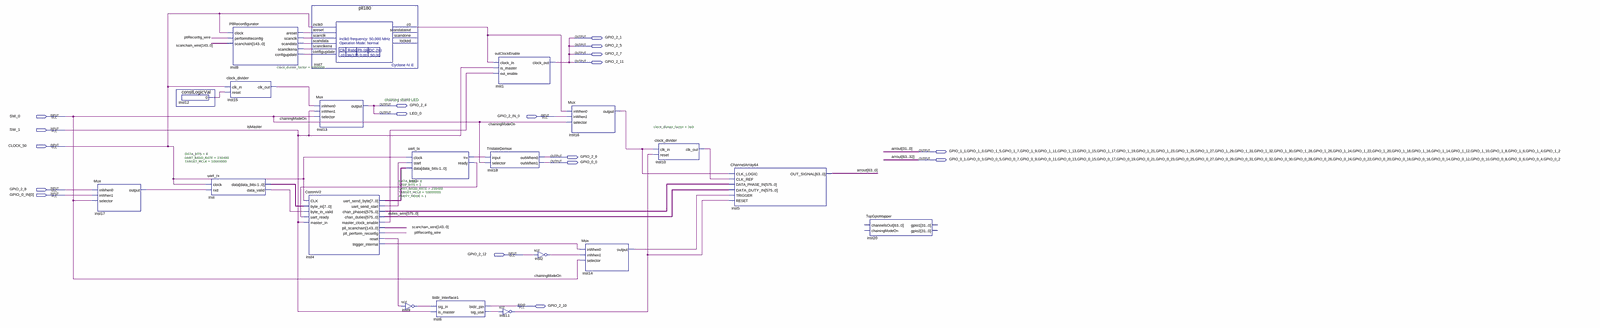
[diagram p0: schematic sheet, whole]
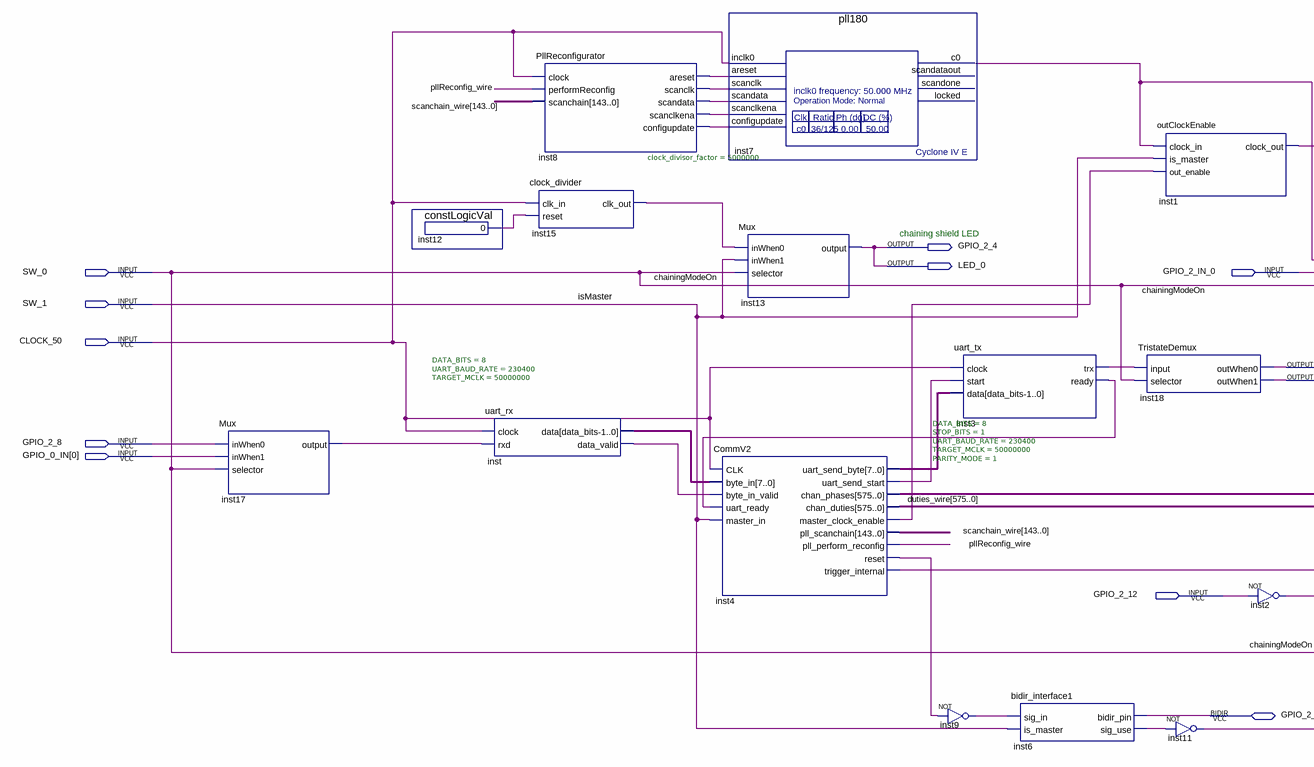
[diagram p1: schematic sheet, left part]
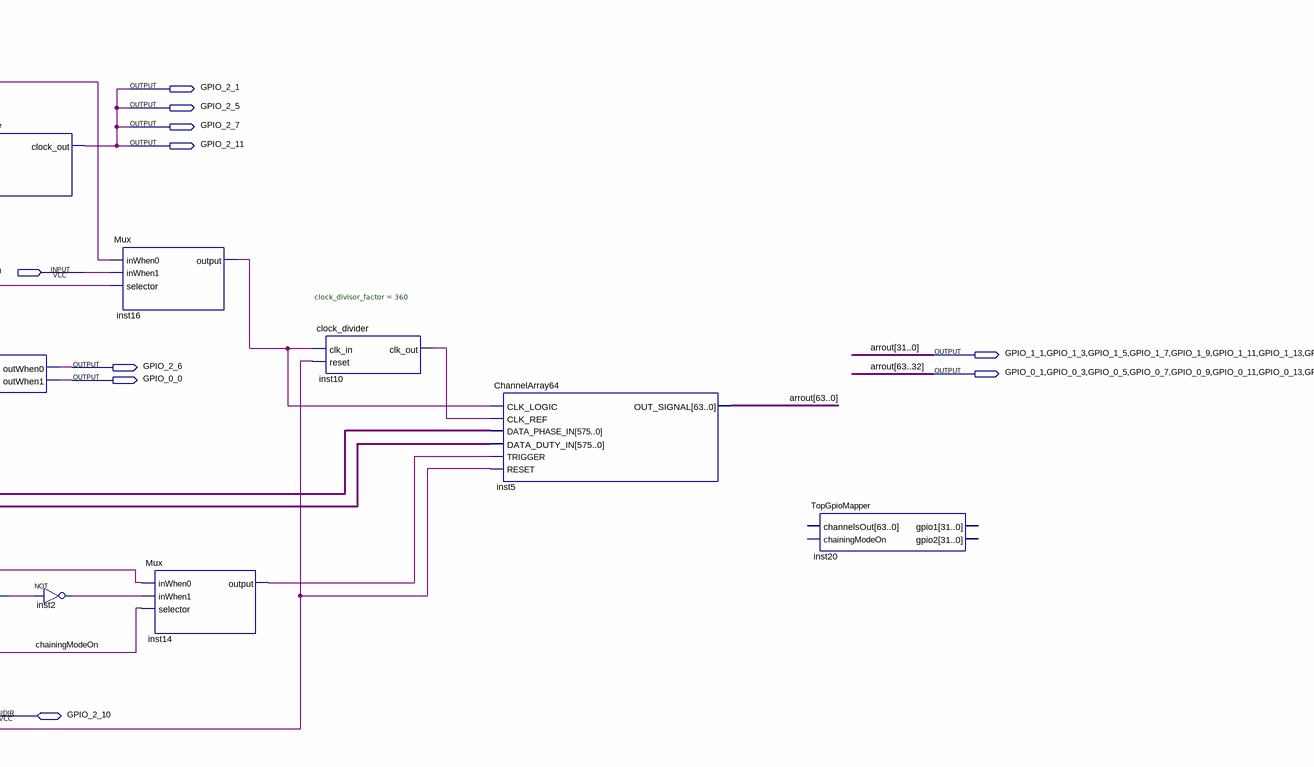
[diagram p2: schematic sheet, centre part]
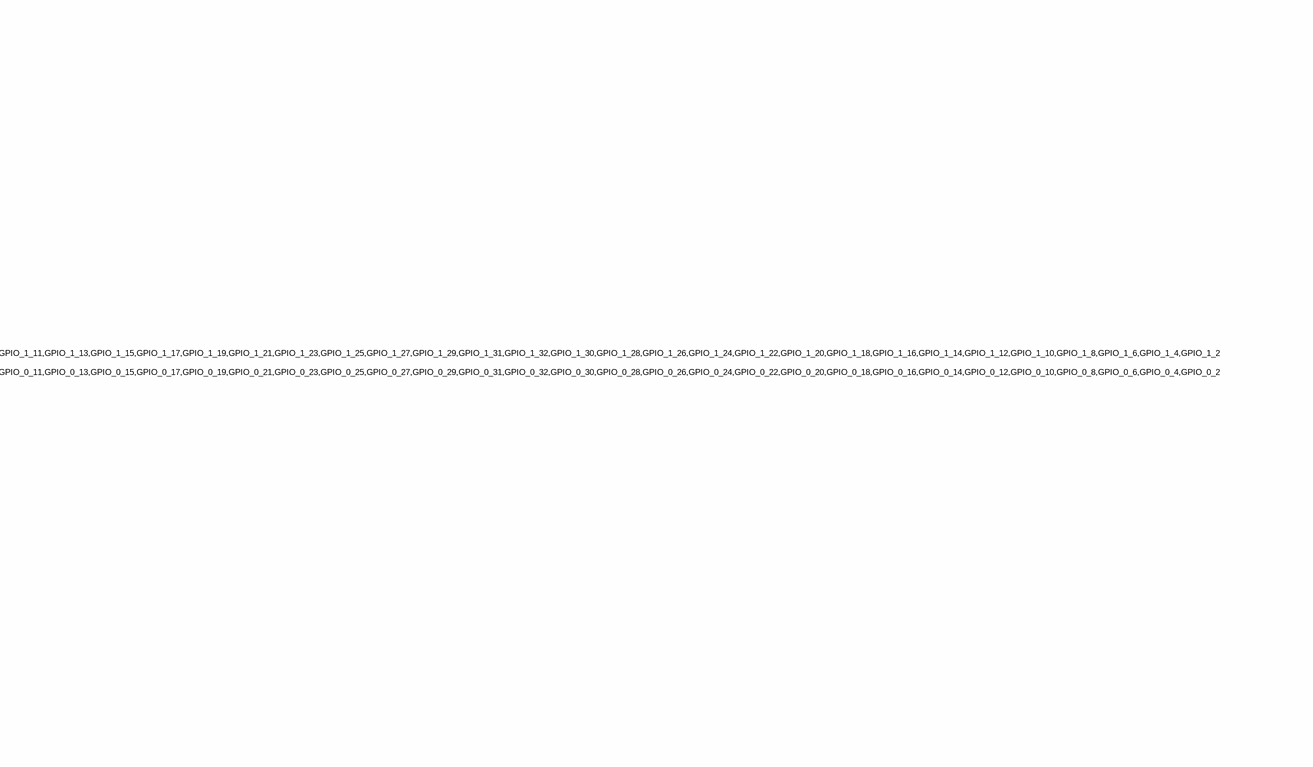
[diagram p3: schematic sheet, right part]
// Quartus schematic ShiftedSignalGenerator.bdf as structural Verilog: 20 symbols, 18 pins
module ShiftedSignalGenerator (
  input  SW_0,
  input  GPIO_2_IN_0,
  input  SW_1,
  input  CLOCK_50,
  input  GPIO_2_8,
  input  [0:0] GPIO_0_IN,
  input  GPIO_2_12,
  inout  GPIO_2_10,
  output GPIO_2_1,
  output GPIO_2_5,
  output GPIO_2_7,
  output GPIO_2_11,
  output GPIO_2_4,
  output LED_0,
  output GPIO_1_1,
  output GPIO_1_3,
  output GPIO_1_5,
  output GPIO_1_7,
  output GPIO_1_9,
  output GPIO_1_11,
  output GPIO_1_13,
  output GPIO_1_15,
  output GPIO_1_17,
  output GPIO_1_19,
  output GPIO_1_21,
  output GPIO_1_23,
  output GPIO_1_25,
  output GPIO_1_27,
  output GPIO_1_29,
  output GPIO_1_31,
  output GPIO_1_32,
  output GPIO_1_30,
  output GPIO_1_28,
  output GPIO_1_26,
  output GPIO_1_24,
  output GPIO_1_22,
  output GPIO_1_20,
  output GPIO_1_18,
  output GPIO_1_16,
  output GPIO_1_14,
  output GPIO_1_12,
  output GPIO_1_10,
  output GPIO_1_8,
  output GPIO_1_6,
  output GPIO_1_4,
  output GPIO_1_2,
  output GPIO_2_6,
  output GPIO_0_1,
  output GPIO_0_3,
  output GPIO_0_5,
  output GPIO_0_7,
  output GPIO_0_9,
  output GPIO_0_11,
  output GPIO_0_13,
  output GPIO_0_15,
  output GPIO_0_17,
  output GPIO_0_19,
  output GPIO_0_21,
  output GPIO_0_23,
  output GPIO_0_25,
  output GPIO_0_27,
  output GPIO_0_29,
  output GPIO_0_31,
  output GPIO_0_32,
  output GPIO_0_30,
  output GPIO_0_28,
  output GPIO_0_26,
  output GPIO_0_24,
  output GPIO_0_22,
  output GPIO_0_20,
  output GPIO_0_18,
  output GPIO_0_16,
  output GPIO_0_14,
  output GPIO_0_12,
  output GPIO_0_10,
  output GPIO_0_8,
  output GPIO_0_6,
  output GPIO_0_4,
  output GPIO_0_2,
  output GPIO_0_0
);

  wire inst2_out, inst3_ready, inst3_trx, inst4_master_clock_enable, inst4_reset, inst4_trigger_internal,
       inst4_uart_send_start, inst6_sig_use, inst7_c0, inst8_areset, inst8_configupdate, inst8_scanclk,
       inst8_scanclkena, inst8_scandata, inst9_out, inst10_clk_out, inst11_out, inst12_result, inst14_output,
       inst15_clk_out, inst16_output, inst17_output, inst_data_valid, pllReconfig_wire;
  wire [7:0] inst4_uart_send_byte, inst_data;
  wire [143:0] scanchain_wire;
  wire [575:0] duties_wire, inst4_chan_phases;

  Mux inst17 (.inWhen0(GPIO_2_8), .inWhen1(GPIO_0_IN[0]), .selector(SW_0), .\output (inst17_output));
  constLogicVal inst12 (.result(inst12_result));
  uart_rx #(.DATA_BITS(8), .UART_BAUD_RATE(230400), .TARGET_MCLK(50000000)) inst (
    .clock(CLOCK_50), .rxd(inst17_output), .data(inst_data), .data_valid(inst_data_valid));
  PllReconfigurator inst8 (
    .clock(CLOCK_50), .performReconfig(pllReconfig_wire), .scanchain(scanchain_wire), .areset(inst8_areset),
    .scanclk(inst8_scanclk), .scandata(inst8_scandata), .scanclkena(inst8_scanclkena),
    .configupdate(inst8_configupdate));
  clock_divider #(.clock_divisor_factor(5000000)) inst15 (
    .clk_in(CLOCK_50), .reset(inst12_result), .clk_out(inst15_clk_out));
  pll180 inst7 (
    .inclk0(CLOCK_50), .areset(inst8_areset), .scanclk(inst8_scanclk), .scandata(inst8_scandata),
    .scanclkena(inst8_scanclkena), .configupdate(inst8_configupdate), .c0(inst7_c0));  // open: scandataout, scandone, locked
  Mux inst13 (.inWhen0(inst15_clk_out), .inWhen1(SW_1), .selector(SW_0), .\output (GPIO_2_4));
  CommV2 inst4 (
    .CLK(CLOCK_50), .byte_in(inst_data), .byte_in_valid(inst_data_valid), .uart_ready(inst3_ready),
    .master_in(SW_1), .uart_send_byte(inst4_uart_send_byte), .uart_send_start(inst4_uart_send_start),
    .chan_phases(inst4_chan_phases), .chan_duties(duties_wire),
    .master_clock_enable(inst4_master_clock_enable), .pll_scanchain(scanchain_wire),
    .pll_perform_reconfig(pllReconfig_wire), .reset(inst4_reset), .trigger_internal(inst4_trigger_internal));
  not inst9 (inst9_out, inst4_reset);
  uart_tx #(.DATA_BITS(8), .STOP_BITS(1), .UART_BAUD_RATE(230400), .TARGET_MCLK(50000000), .PARITY_MODE(1)) inst3 (
    .clock(CLOCK_50), .start(inst4_uart_send_start), .data(inst4_uart_send_byte), .trx(inst3_trx),
    .ready(inst3_ready));
  bidir_interface1 inst6 (.sig_in(inst9_out), .is_master(SW_1), .sig_use(inst6_sig_use), .bidir_pin(GPIO_2_10));
  TristateDemux inst18 (.\input (inst3_trx), .selector(SW_0), .outWhen0(GPIO_2_6), .outWhen1(GPIO_0_0));
  outClockEnable inst1 (
    .clock_in(inst7_c0), .is_master(SW_1), .out_enable(inst4_master_clock_enable), .clock_out(GPIO_2_1));
  not inst11 (inst11_out, inst6_sig_use);
  not inst2 (inst2_out, GPIO_2_12);
  Mux inst16 (.inWhen0(inst7_c0), .inWhen1(GPIO_2_IN_0), .selector(SW_0), .\output (inst16_output));
  Mux inst14 (.inWhen0(inst4_trigger_internal), .inWhen1(inst2_out), .selector(SW_0), .\output (inst14_output));
  clock_divider #(.clock_divisor_factor(360)) inst10 (
    .clk_in(inst16_output), .reset(inst11_out), .clk_out(inst10_clk_out));
  ChannelArray64 inst5 (
    .CLK_LOGIC(inst16_output), .CLK_REF(inst10_clk_out), .DATA_PHASE_IN(inst4_chan_phases),
    .DATA_DUTY_IN(duties_wire), .TRIGGER(inst14_output), .RESET(inst11_out),
    .OUT_SIGNAL({GPIO_0_1, GPIO_0_3, GPIO_0_5, GPIO_0_7, GPIO_0_9, GPIO_0_11, GPIO_0_13, GPIO_0_15, GPIO_0_17, GPIO_0_19, GPIO_0_21, GPIO_0_23, GPIO_0_25, GPIO_0_27, GPIO_0_29, GPIO_0_31, GPIO_0_32, GPIO_0_30, GPIO_0_28, GPIO_0_26, GPIO_0_24, GPIO_0_22, GPIO_0_20, GPIO_0_18, GPIO_0_16, GPIO_0_14, GPIO_0_12, GPIO_0_10, GPIO_0_8, GPIO_0_6, GPIO_0_4, GPIO_0_2, GPIO_1_1, GPIO_1_3, GPIO_1_5, GPIO_1_7, GPIO_1_9, GPIO_1_11, GPIO_1_13, GPIO_1_15, GPIO_1_17, GPIO_1_19, GPIO_1_21, GPIO_1_23, GPIO_1_25, GPIO_1_27, GPIO_1_29, GPIO_1_31, GPIO_1_32, GPIO_1_30, GPIO_1_28, GPIO_1_26, GPIO_1_24, GPIO_1_22, GPIO_1_20, GPIO_1_18, GPIO_1_16, GPIO_1_14, GPIO_1_12, GPIO_1_10, GPIO_1_8, GPIO_1_6, GPIO_1_4, GPIO_1_2}));
  TopGpioMapper inst20 ();  // open: channelsOut, chainingModeOn, gpio1, gpio2

  assign GPIO_2_5 = GPIO_2_1;
  assign GPIO_2_7 = GPIO_2_1;
  assign GPIO_2_11 = GPIO_2_1;
  assign LED_0 = GPIO_2_4;

  // Other names for the same wires on the sheet: arrout[63:0] = {GPIO_0_1, GPIO_0_3, GPIO_0_5, GPIO_0_7, GPIO_0_9, GPIO_0_11, GPIO_0_13, GPIO_0_15, GPIO_0_17, GPIO_0_19, GPIO_0_21, GPIO_0_23, GPIO_0_25, GPIO_0_27, GPIO_0_29, GPIO_0_31, GPIO_0_32, GPIO_0_30, GPIO_0_28, GPIO_0_26, GPIO_0_24, GPIO_0_22, GPIO_0_20, GPIO_0_18, GPIO_0_16, GPIO_0_14, GPIO_0_12, GPIO_0_10, GPIO_0_8, GPIO_0_6, GPIO_0_4, GPIO_0_2, GPIO_1_1, GPIO_1_3, GPIO_1_5, GPIO_1_7, GPIO_1_9, GPIO_1_11, GPIO_1_13, GPIO_1_15, GPIO_1_17, GPIO_1_19, GPIO_1_21, GPIO_1_23, GPIO_1_25, GPIO_1_27, GPIO_1_29, GPIO_1_31, GPIO_1_32, GPIO_1_30, GPIO_1_28, GPIO_1_26, GPIO_1_24, GPIO_1_22, GPIO_1_20, GPIO_1_18, GPIO_1_16, GPIO_1_14, GPIO_1_12, GPIO_1_10, GPIO_1_8, GPIO_1_6, GPIO_1_4, GPIO_1_2};
  //   isMaster = SW_1; chainingModeOn = SW_0

  // Notes on the sheet:
  //   chaining shield LED
endmodule
